# EAGLE design R017 - SRF-Shield v1.2 (EAGLE 6.1)
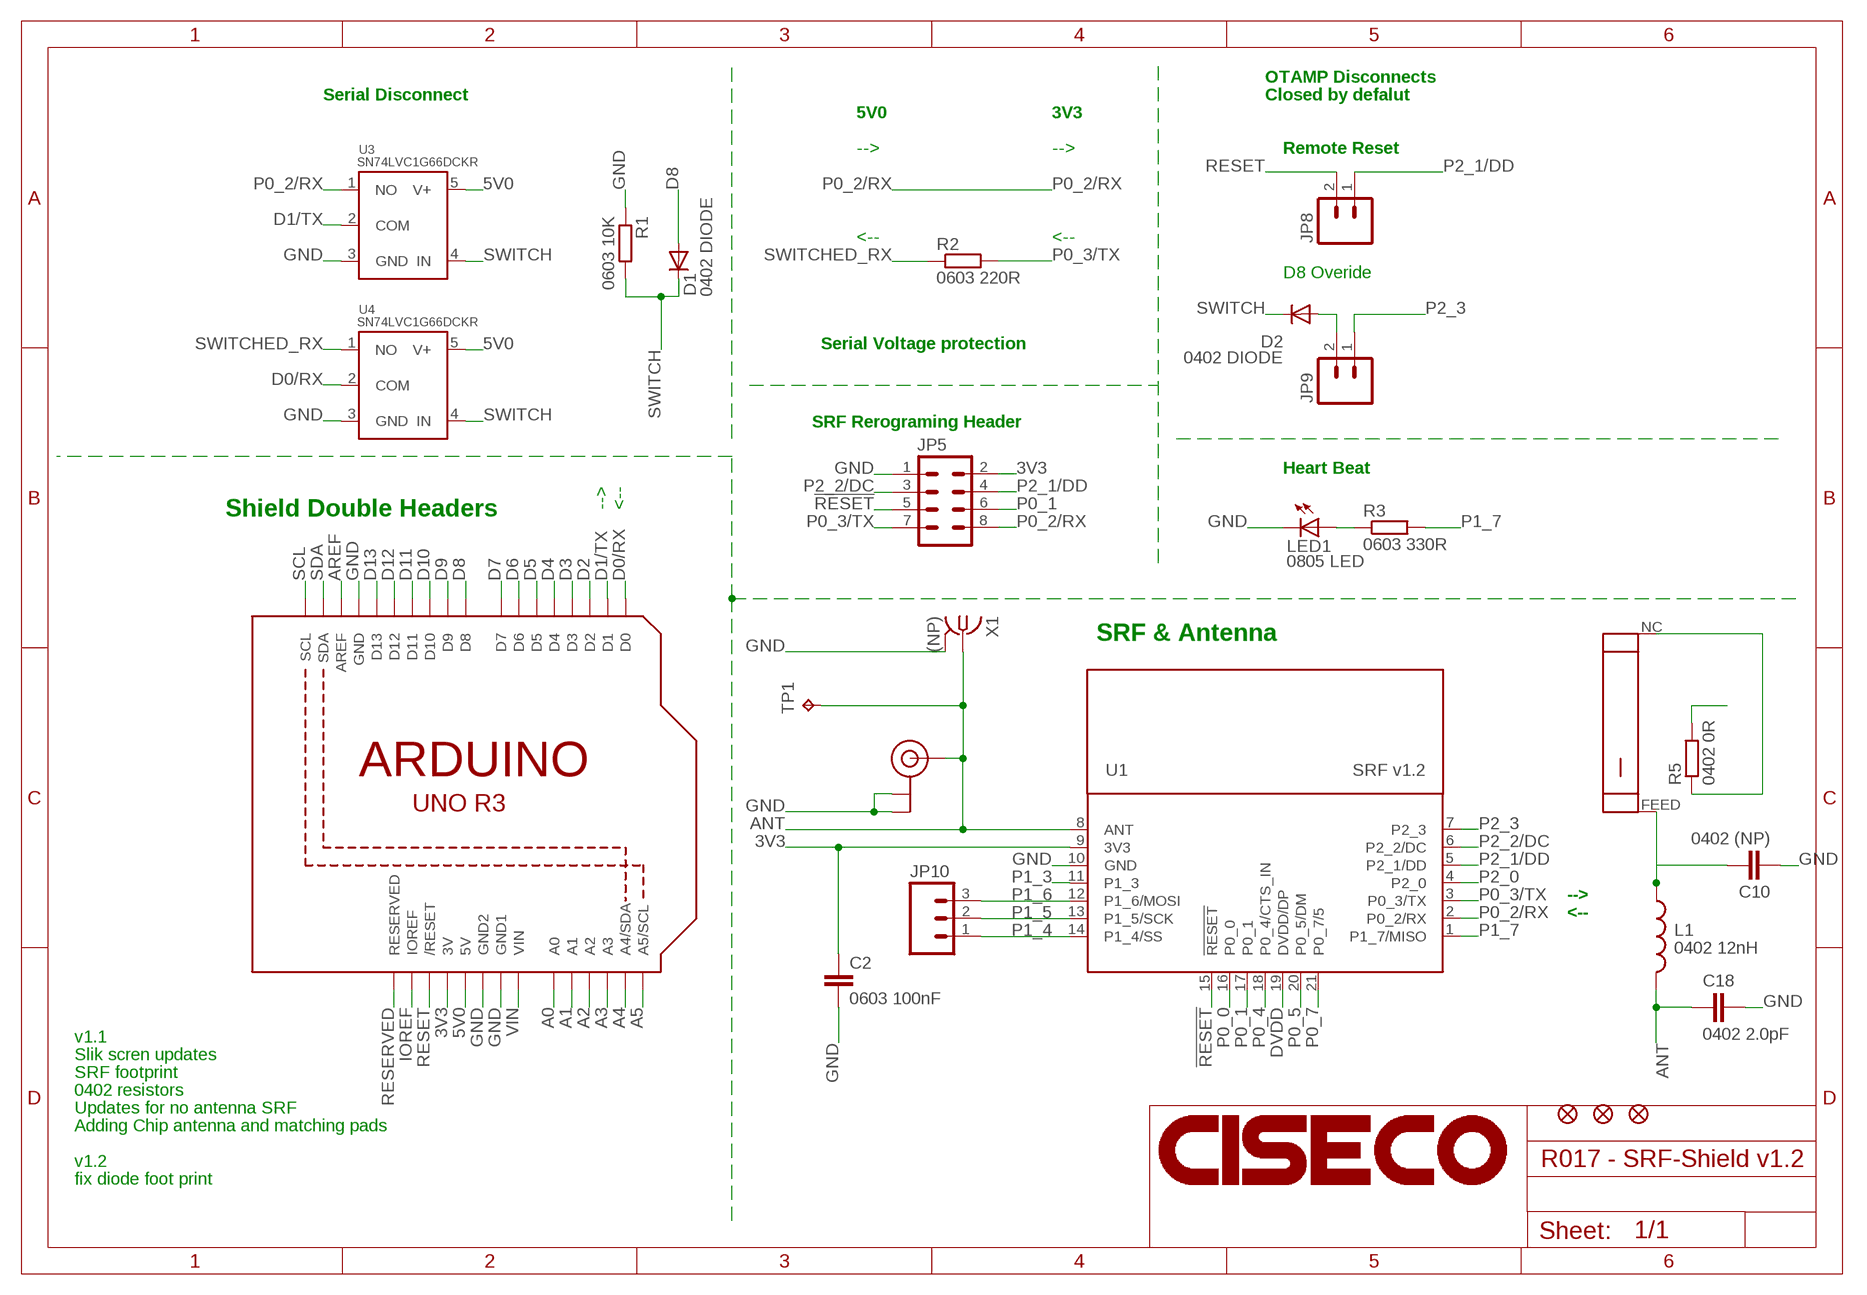
[diagram p0: schematic, sheet 1]

## Parts
C2  0603 100nF  C-EUC0402-SMALLER  [C0402-SMALLER]
C10  0402 (NP)  C-EUC0402-SMALLER  [C0402-SMALLER]
C18  0402 2.0pF  C-EUC0402-SMALLER  [C0402-SMALLER]
D1  0402 DIODE  DIODE-SOD88  [SOD88]
D2  0402 DIODE  DIODE-SOD88  [SOD88]
JP4  FIDUCIAL1X2.5-STOP  [FIDUCIAL-1X2.5-STOP]
JP5  M04X2  [2X4]
JP6  FIDUCIAL1X2.5-STOP  [FIDUCIAL-1X2.5-STOP]
JP7  FIDUCIAL1X2.5-STOP  [FIDUCIAL-1X2.5-STOP]
JP8  M02PTH  [1X02]
JP9  M02PTH  [1X02]
JP10  M03PTH  [1X03]
L1  0402 12nH  INDUCTOR0402-SMALLER  [C0402-SMALLER]
LED1  0805 LED  LED0805-1206  [LED-0805-1206]
R1  0603 10K  R-EU_R0402-SMALLER  [R0402-SMALLER]
R2  0603 220R  R-EU_R0402-SMALLER  [R0402-SMALLER]
R3  0603 330R  R-EU_R0402-SMALLER  [R0402-SMALLER]
R5  0402 0R  R-EU_R0402-SMALLER  [R0402-SMALLER]
TP1  TPPAD1-13  [P1-13]
U1  SRF v1.2  SRF-LANDING-NO-ANT-1.2  [SRF-LANDING-NO-ANT-1.2]
U2  ARDUINOR3-DOUBL-OFFSET  [ARDUINOR3-DOUBLE-OFFSET]
U3  SN74LVC1G66DCKR  TI-TS5A1066-SC7  [SC70]
U4  SN74LVC1G66DCKR  TI-TS5A1066-SC7  [SC70]
U5  U.FL (NP)  U.FL  [U.FL]
U6  JTICHIPANT  JTICHIPANT-ROTATED  [JTICHIPANT-ROT]
U$3  CISECO-LARGE  [CISECO-4MM]
X1  (NP)  SMA-142-0711-821/826-LWK1  [J502-ND-142-0711-821/826-LWK1]

## Nets
3V3: C2.1 JP5.2 U1.9(3V3) U2.3V U2.3V1(3V)
5V0: U2.5V U2.5V1(5V) U3.5(V+) U4.5(V+)
!RESET: JP5.5 U1.15(!RESET)
A0: U2.A0 U2.A6(A0)
A1: U2.A1 U2.A7(A1)
A2: U2.A2 U2.A8(A2)
A3: U2.A3 U2.A9(A3)
A4: U2.A4(A4/SDA) U2.A10(A4/SDA)
A5: U2.A5(A5/SCL) U2.A11(A5/SCL)
ANT [ANT]: C18.1 L1.2 TP1.TP U1.8(ANT) U5.P$3(SIGNAL) X1.1
AREF: U2.AREF U2.AREF1(AREF)
D0/RX: U2.D0 U2.D18(D0) U4.2(COM)
D1/TX: U2.D1 U2.D17(D1) U3.2(COM)
D2: U2.D2 U2.D16(D2)
D3: U2.D3 U2.D15(D3)
D4: U2.D4 U2.D14(D4)
D5: U2.D5 U2.D19(D5)
D6: U2.D6 U2.D20(D6)
D7: U2.D7 U2.D21(D7)
D8: D1.A U2.D8 U2.D22(D8)
D9: U2.D9 U2.D23(D9)
D10: U2.D10 U2.D24(D10)
D11: U2.D11 U2.D25(D11)
D12: U2.D12 U2.D26(D12)
D13: U2.D13 U2.D27(D13)
DVDD: U1.19(DVDD/DP)
GND: C2.2 C10.1 C18.2 JP5.1 LED1.C R1.1 U1.10(GND) U2.GND U2.GND1 U2.GND2 U2.GND3(GND1) U2.GND4(GND2) U2.GND5(GND) U3.3(GND) U4.3(GND) U5.P$1(GND) U5.P$2(GND) X1.G@1(GND)
IOREF: U2.IOREF U2.IOREF1(IOREF)
N$2: LED1.A R3.1
N$11: R5.2
N$39 [ANT]: C10.2 L1.1 U6.FEED
N$40: R5.1 U6.NC
OTAMP_M: D2.A JP9.2
P0_0: U1.16(P0_0)
P0_1: JP5.6 U1.17(P0_1)
P0_2/RX: JP5.8 U1.2(P0_2/RX) U3.1(NO)
P0_3/TX: JP5.7 R2.2 U1.3(P0_3/TX)
P0_4: U1.18(P0_4/CTS_IN)
P0_5: U1.20(P0_5/DM)
P0_7: U1.21(P0_7/5)
P1_3: U1.11(P1_3)
P1_4: JP10.1 U1.14(P1_4/SS)
P1_5: JP10.2 U1.13(P1_5/SCK)
P1_6: JP10.3 U1.12(P1_6/MOSI)
P1_7: R3.2 U1.1(P1_7/MISO)
P2_0: U1.4(P2_0)
P2_1/DD: JP5.4 JP8.1 U1.5(P2_1/DD)
P2_2/DC: JP5.3 U1.6(P2_2/DC)
P2_3: JP9.1 U1.7(P2_3)
RESERVED: U2.RESERVED U2.RESERVED1(RESERVED)
RESET: JP8.2 U2.RESET1(/RESET) U2.RESET(/RESET)
SCL: U2.SCL U2.SCL1(SCL)
SDA: U2.SDA U2.SDA1(SDA)
SWITCH: D1.C D2.C R1.2 U3.4(IN) U4.4(IN)
SWITCHED_RX: R2.1 U4.1(NO)
VIN: U2.VIN U2.VIN1(VIN)

## Notes on the sheet
- OTAMP Disconnects
- Serial Disconnect | Closed by defalut
- 5V0 | 3V3
- --> | --> | Remote Reset
- <-- | <--
- D8 Overide
- Serial Voltage protection
- SRF Rerograming Header
- Heart Beat
- --> | <--
- Shield Double Headers
- SRF & Antenna
- -->
- <--
- v1.1
- Slik scren updates
- SRF footprint
- 0402 resistors
- Updates for no antenna SRF
- Adding Chip antenna and matching pads
- v1.2
- fix diode foot print

## Power pins joined to a net without a drawn wire
GND: X1.G@2(GND) X1.G@3(GND) X1.G@4(GND)

## Library data of the parts
C2 C10 C18 = CISECO eaglecad designs:C-EU: CAPACITOR, European symbol
D1 D2 = CISECO eaglecad designs:DIODE-: DIODE
JP4 JP6 JP7 = CISECO eaglecad designs:FIDUCIAL: Fiducial Alignment Points Various fiducial points for machine vision alignment.
JP5 = SparkFun:M04X2
JP8 JP9 = CISECO eaglecad designs:M02: Header 2 Standard 2-pin 0.1" header. Use with straight break away headers (SKU : PRT-00116), right angle break away headers (PRT-00553), swiss pins (PRT-00743), machine pins (PRT-00117), and female headers (PRT-00115). Molex polarized connector foot print use with SKU : PRT-08233 with associated crimp pins and housings.
JP10 = CISECO eaglecad designs:M03: Header 3 Standard 3-pin 0.1" header. Use with straight break away headers (SKU : PRT-00116), right angle break away headers (PRT-00553), swiss pins (PRT-00743), machine pins (PRT-00117), and female headers (PRT-00115). Molex polarized connector foot print use with SKU : PRT-08232 with associated crimp pins and housings.
L1 = CISECO eaglecad designs:INDUCTOR: Inductors Basic Inductor/Choke - 0603 and 1206. Footprints are not proven and vary greatly between part numbers.
LED1 = CISECO eaglecad designs:LED: LEDs Standard schematic elements and footprints for 5mm, 3mm, 1206, and 0603 sized LEDs. 5mm - Spark Fun Electronics SKU : COM-00529 (and others)
R1-R3 R5 = CISECO eaglecad designs:R-EU_: RESISTOR, European symbol
TP1 = CISECO eaglecad designs:TP: Test pad
U1 = Ciseco Footprints:SRF: SRF Wireless UART Serial Data Module. www.ciseco.co.uk
U2 = CISECO eaglecad designs:ARDUINOR3: This is a new object for the new Arduino R3 - with extra pins that you may want to use (such as IOref, and duplicated A4/A5
U3 U4 = CISECO eaglecad designs:TI-TS5A1066
U5 = CISECO eaglecad designs:U.FL
U6 = CISECO eaglecad designs:JTICHIPANT
U$3 = CISECO eaglecad designs:CISECO
X1 = CISECO eaglecad designs:SMA-: SMA 50 Ohm End Launch Jack Receptacle - Round Contact Johnson Components Source: www.johnsoncomponents.com .. J502-ND.pdf

## Net classes
1 ANT: width 1.27 mm, drill 0.3 mm, clearance 0.381 mm
6 ANT6: width 0.61 mm, drill 0.254 mm, clearance 0.381 mm

## Board
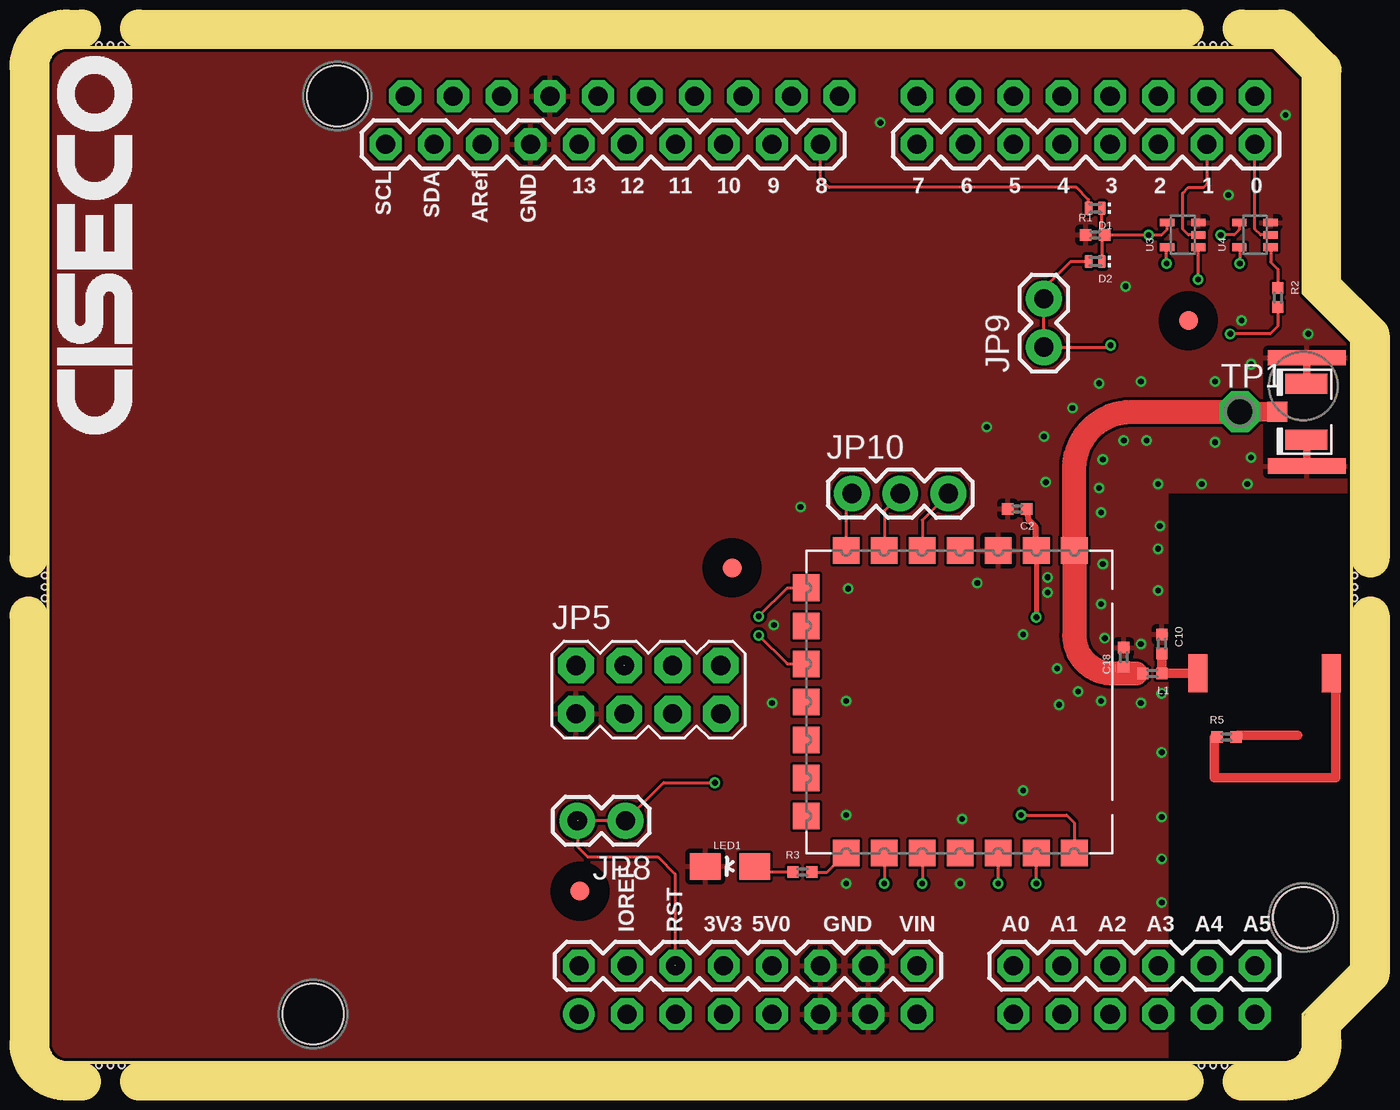
[diagram p1: board, top side]
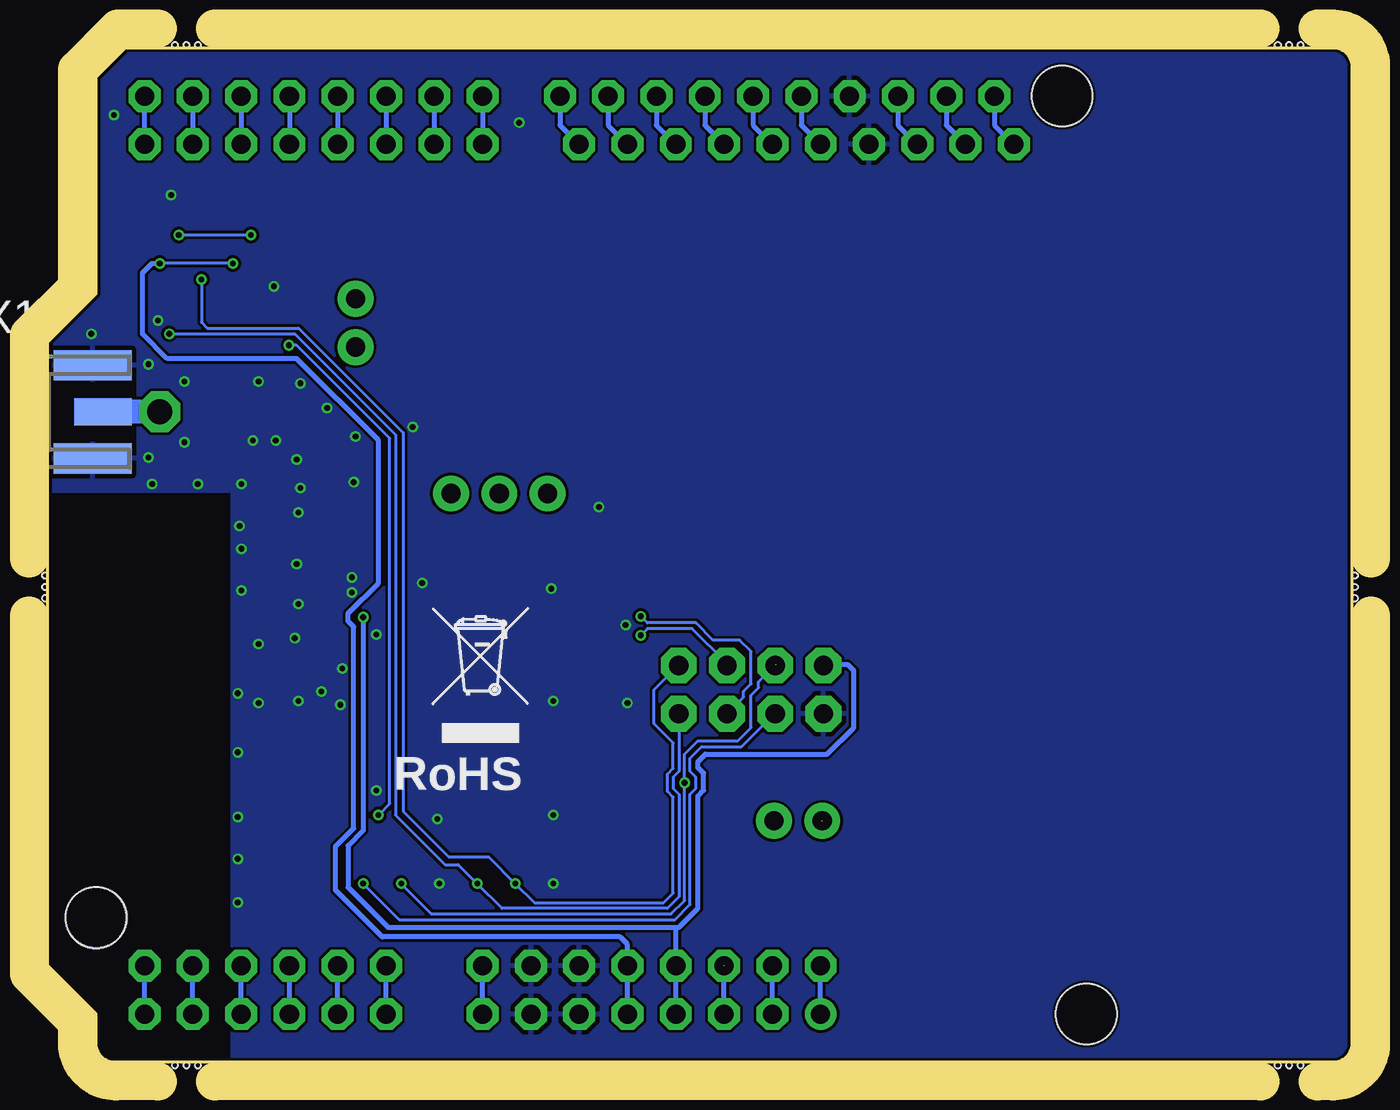
[diagram p2: board, bottom side, seen from below]

Size 68.6 x 53.35 mm. Coordinates in mm from the lower left corner, seen from the top.
Outline: 0,52.35 0,1 arc90 1,0 65.05,0 arc90 66.05,1 66.05,2.55 68.6,5.1 68.6,37.85 66.05,40.4 66.05,51.8 64.5,53.35 1,53.35 arc90 0,52.35
Copper layers (1*16): Top 0.035mm / dielectric 1mm / Bottom 0.035mm
Design rules: minimum track width 0.15mm, minimum drill 0.3mm, track to track 0.15mm, track to pad 0.15mm, pad to pad 0.15mm, via to via 0.15mm, smd to smd 0.15mm, copper to edge 0.15mm, drill to drill 0.15mm, minimum pad ring 10mil, minimum via ring 5mil, stop-mask expansion 4mil, vias tented up to drill 0.6mm, thermal gap 10mil
Holes 3.2 mm at 66.05,7.6 15.24,50.8 13.97,2.54 66.04,7.62
Holes 0.3 mm at 2.7,53.49 3.9,53.49 3.3,53.49 68.73,25.6 68.73,25 68.73,24.4 60.7,53.49 61.3,53.49 61.9,53.49 3.9,-0.15 3.3,-0.15 2.7,-0.15 61.9,-0.15 61.3,-0.15 60.7,-0.15 -0.15,24.4 -0.15,25 -0.15,25.6
tRestrict: area 63.9,31.8 to 68.4,36.6
bRestrict: area 63.9,32.7 to 68.4,35.8
Milling: 18 lines

### Footprints (pad centres in the part's own frame; a part is rotated, then mirrored left to right if it is on the bottom)
C0402-SMALLER = smd 0.6 x 0.6: 1 -0.5,0; 2 0.5,0
SOD88 = smd 0.4 x 0.7: A 0.35,0; C -0.35,0
FIDUCIAL-1X2.5-STOP = smd 1 x 1: 1 0,0
2X4 = drill 1.016 pad 1.88 octagon: 1 -3.81,-1.27; 2 -3.81,1.27; 3 -1.27,-1.27; 4 -1.27,1.27; 5 1.27,-1.27; 6 1.27,1.27; 7 3.81,-1.27; 8 3.81,1.27
1X02 = drill 1.016 pad 1.88: 1 0,0; 2 2.54,0
1X03 = drill 1.016 pad 1.88: 1 0,0; 2 2.54,0; 3 5.08,0
LED-0805-1206 = smd 1.6 x 1.4: A 1.3,0; C -1.3,0
R0402-SMALLER = smd 0.6 x 0.6: 1 -0.5,0; 2 0.5,0
P1-13 = drill 1.321 pad 2.159 octagon: TP 0,0
SRF-LANDING-NO-ANT-1.2 = smd 1.4 x 1.4: 1 15.9,2; 2 15.9,4; 3 15.9,6; 4 15.9,8; 5 15.9,10; 6 15.9,12; 7 15.9,14; 8 0,14; 9 0,12; 10 0,10; 11 0,8; 12 0,6; 13 0,4; 14 0,2; 15 1.95,-0.1; 16 3.95,-0.1; 17 5.95,-0.1; 18 7.95,-0.1; 19 9.95,-0.1; 20 11.95,-0.1; 21 13.95,-0.1
ARDUINOR3-DOUBLE-OFFSET = drill 1 pad 1.676 octagon: 3V 35.56,2.54; 3V1 35.56,5.08; 5V 38.1,2.54; 5V1 38.1,5.08; A0 50.8,2.54; A1 53.34,2.54; A2 55.88,2.54; A3 58.42,2.54; A4 60.96,2.54; A5 63.5,2.54; A6 50.8,5.08; A7 53.34,5.08; A8 55.88,5.08; A9 58.42,5.08; A10 60.96,5.08; A11 63.5,5.08; AREF 23.876,50.8; AREF1 22.86,48.26; D0 63.5,50.8; D1 60.96,50.8; D2 58.42,50.8; D3 55.88,50.8; D4 53.34,50.8; D5 50.8,50.8; D6 48.26,50.8; D7 45.72,50.8; D8 41.656,50.8; D9 39.116,50.8; D10 36.576,50.8; D11 34.036,50.8; D12 31.496,50.8; D13 28.956,50.8; D14 53.34,48.26; D15 55.88,48.26; D16 58.42,48.26; D17 60.96,48.26; D18 63.5,48.26; D19 50.8,48.26; D20 48.26,48.26; D21 45.72,48.26; D22 40.64,48.26; D23 38.1,48.26; D24 35.56,48.26; D25 33.02,48.26; D26 30.48,48.26; D27 27.94,48.26; GND 26.416,50.8; GND1 43.18,2.54; GND2 40.64,2.54; GND3 43.18,5.08; GND4 40.64,5.08; GND5 25.4,48.26; IOREF 30.48,2.54; IOREF1 30.48,5.08; RESERVED1 27.94,5.08; RESET 33.02,2.54; RESET1 33.02,5.08; SCL 18.796,50.8; SCL1 17.78,48.26; SDA 21.336,50.8; SDA1 20.32,48.26; VIN 45.72,2.54; VIN1 45.72,5.08 | drill 1 pad 1.676: RESERVED 27.94,2.54
SC70 = smd 0.4 x 0.75: 1 -0.65,-0.825; 2 0,-0.825; 3 0.65,-0.825; 4 0.65,0.825; 5 -0.65,0.825
U.FL = smd 2.2 x 1.05: P$1 0,1.475; P$2 0,-1.475 | smd 1.05 x 1.05: P$3 1.525,0
JTICHIPANT-ROT = smd 1 x 2: FEED -3.51,0; NC 3.51,0
J502-ND-142-0711-821/826-LWK1 = smd 3 x 1.422: 1 2.815,0 | smd 4.1 x 1.6: G@1 2.265,2.45; G@2 2.265,-2.45 | smd 4.1 x 0.8 bottom: G@3 2.265,2.85; G@4 2.265,-2.85

### Placement (x,y rotation side)
C2  51,29.1 180 top
C10  58.6,22 270 top
C18  56.6,21.3 90 top
D1  55.1,44.9 180 top
D2  55.1,42.1 180 top
JP4  36,26 0 top
JP5  31.6,19.6 0 top
JP6  60,39 0 top
JP7  28,9 0 top
JP8  30.4,12.7 180 top
JP9  52.4,37.6 90 top
JP10  42.3,29.9 0 top
L1  58.1,20.45 180 top
LED1  35.9,10.3 0 top
R1  55.1,43.5 0 top
R2  64.7,40.2 270 top
R3  39.7,10 0 top
R5  62,17.1 0 top
TP1  62.7,34.2 0 top
U1  40,26.9 270 top
U2  0,0 0 top
U3  59.7,43.5 90 top
U4  63.5,43.5 90 top
U5  66.2,34.2 180 top
U6  64,20.45 0 top
U$3  4.5,33 90 top
U$6  [WEEE-LOGO]  48.4,16.8 0 bottom
X1  68.5,34.2 0 bottom

### Tracks (layer width: path | path; a pad name or v marks a point on that pad's centre or on a via)
3V3  (via drill 0.3)
  Top 0.254: U1.9 v52,23.4
  Top 0.305: U1.9 51.98,26.93 51.98,28.12 51.6,28.5 C2.1
  Bottom 0.15: 35.56,7.04 35.5,7.1 35.4,7.1
  Bottom 0.254: 35.4,7.1 34.4,8.1 34.4,14 34.1,14.3 34.1,15.2 34.4,15.5 34.4,15.8 34,16.2 27.6,16.2 26.2,17.6 26.2,20.6 26.5,20.9 27.76,20.9 JP5.2 | v52,23.4 52,12.2 52.8,11.4 52.8,9.2 50.7,7.1 35.5,7.1 | 35.56,7.04 U2.3V1 U2.3V
5V0  (via drill 0.3)
  Top 0.15: U4.5 62.67,42.83 62.7,42.8 v62.7,42 | v58.85,42 58.85,42.83 U3.5
  Bottom 0.15: v58.85,42 v62.7,42
  Bottom 0.254: v62.7,42 63.1,42 63.6,41.5 63.6,38.3 62.3,37 55.5,37 51.2,32.7 51.2,25.2 52.8,23.6 52.8,23.2 52.5,22.9 52.5,12.3 53.45,11.35 53.45,9.05 51,6.6 38.5,6.6 38.1,6.2 U2.5V1 U2.5V
!RESET  (via drill 0.3)
  Top 0.15: U1.15 38.9,24.95 v37.4,23.45
  Bottom 0.15: JP5.5 32,19.2 32,19.5 31.6,19.9 31.6,21.6 32.2,22.2 33.6,22.2 34.5,23.1 37.05,23.1 v37.4,23.45
A0
  Bottom 0.254: U2.A0 U2.A6
A1
  Bottom 0.254: U2.A1 U2.A7
A2
  Bottom 0.254: U2.A2 U2.A8
A3
  Bottom 0.254: U2.A3 U2.A9
A4
  Bottom 0.254: U2.A4 U2.A10
A5
  Bottom 0.254: U2.A5 U2.A11
ANT
  Top 0.5: C18.1 56.6,20.45 57.25,20.45 L1.2
  Top 1.016: U5.P$3 TP1.TP
  Top 1.27: TP1.TP 57,34.2 arc90 54,31.2 U1.8 54,22.45 arc90 56,20.45 57.25,20.45
  Bottom 1.27: TP1.TP X1.1
AREF
  Bottom 0.254: U2.AREF 23.88,49.28 U2.AREF1
D0/RX
  Top 0.15: U4.2 63.8,43.5 63.5,43.8 U2.D18
  Bottom 0.254: U2.D18 U2.D0
D1/TX
  Top 0.15: U3.2 60,43.5 59.7,43.8 59.7,45.7 60,46 60.8,46 61,46.2 61,48.22 U2.D17
  Bottom 0.254: U2.D1 U2.D17
D2
  Bottom 0.254: U2.D2 U2.D16
D3
  Bottom 0.254: U2.D3 U2.D15
D4
  Bottom 0.254: U2.D4 U2.D14
D5
  Bottom 0.254: U2.D5 U2.D19
D6
  Bottom 0.254: U2.D6 U2.D20
D7
  Bottom 0.254: U2.D7 U2.D21
D8
  Top 0.15: U2.D22 40.66,46.44 41.1,46 54.1,46 54.75,45.35 D1.A
  Bottom 0.254: U2.D8 41.66,49.28 U2.D22
D9
  Bottom 0.254: U2.D9 39.12,49.28 U2.D23
D10
  Bottom 0.254: U2.D10 36.58,49.28 U2.D24
D11
  Bottom 0.254: U2.D11 34.04,49.28 U2.D25
D12
  Bottom 0.254: U2.D12 31.5,49.28 U2.D26
D13
  Bottom 0.254: U2.D13 28.96,49.28 U2.D27
GND  (via drill 0.3)
  Top 0.406: U5.P$2 66.23,35.67 X1.G@3 | U5.P$1 66.23,32.73 X1.G@4
  other vias: 58.6,12.9 58.6,16.3 57.5,18.9 57.5,22 58.4,24.8 55.5,26.2 48.9,25.2 51.3,14.3 42,13 42.1,24.9 42,19 53.2,18.8 58.4,30.4 63.1,30.4 63.3,31.8 61.4,32.6 61.4,35.8 63.3,36.7 66.3,38.3 52.5,30.5 52.4,32.9 55.5,31.7 56.6,32.7 57.8,32.7 55.3,35.7 53.9,34.4 51.3,22.5 48.1,12.8 57.5,35.8 58.5,28.2 49.4,33.4 56.7,40.8 62.1,45.6 65.1,49.8 43.8,49.4 39.6,29.2 58.6,10.7 60.7,30.4 52.6,25.5 58.4,27 48,9.4 42,9.4 58.6,8.4 38.1,18.9 38.2,23 62.8,39 52.6,24.7 53.1,20.7 54.2,19.5 55.4,19 58.6,19.4 55.6,22.3 55.4,24.1 55.4,28.9 55.3,30.2
  pour Top: 0,52.35 0,1 arc90 1,0 58.9,0 58.9,30 68.6,30 68.6,37.85 66.05,40.4 66.05,51.8 64.5,53.35 1,53.35 arc90
  pour Bottom: 0,52.35 0,1 arc90 1,0 58.9,0 58.9,30 68.6,30 68.6,37.85 66.05,40.4 66.05,51.8 64.5,53.35 1,53.35 arc90
IOREF
  Bottom 0.254: U2.IOREF U2.IOREF1
N$2
  Top 0.15: R3.1 37.2,10 LED1.A
N$11
  Top 0.5: R5.2 62.6,17.2 65.75,17.2
N$39
  Top 0.5: U6.FEED L1.1 C10.2
N$40
  Top 0.5: U6.NC 67.75,20.45 67.75,14.95 61.35,14.95 61.35,17.1 R5.1
OTAMP_M
  Top 0.15: D2.A 53.8,42.1 52.4,40.7 52.4,40.2 JP9.2
P0_1  (via drill 0.3)
  Top 0.15: U1.17 38.9,20.95 v37.4,22.45
  Bottom 0.15: JP5.6 32.87,20.97 34.7,22.8 37.05,22.8 v37.4,22.45
P0_2/RX  (via drill 0.3)
  Top 0.15: v60.5,41.15 60.5,42.8 60.52,42.83 U3.1 | U1.2 v44,9.4
  Bottom 0.15: v60.5,41.15 60.5,38.9 60.2,38.6 55.4,38.6 49.9,33.1 49.9,13.2 47.5,10.8 45.4,10.8 v44,9.4 43,8.4 36.2,8.4 35.7,8.9 35.7,13.95 36,14.25 36,15.15 35.7,15.45 35.7,16.8 36.7,17.8 36.7,19.6 35.41,20.89 | 35.4,20.9 35.41,20.89 | 35.41,20.89 JP5.8
P0_3/TX  (via drill 0.3)
  Top 0.15: v62.2,38.3 64.3,38.3 64.7,38.7 R2.2 | U1.3 v46,9.4
  Bottom 0.15: v62.2,38.3 55.6,38.3 50.3,33 50.3,13 47.7,10.4 47,10.4 v46,9.4 44.7,8.1 36,8.1 35.4,8.7 35.4,14.1 35.7,14.4 35.7,15 35.4,15.3 JP5.7
P1_3
  Top 0.15: U1.11 47.92,26.98
P1_4
  Top 0.15: JP10.1 42.3,29.8 42,29.5 U1.14
P1_5
  Top 0.15: JP10.2 44.84,29.84 44,29 U1.13
P1_6
  Top 0.15: JP10.3 47.38,29.88 46,28.5 U1.12
P1_7
  Top 0.15: R3.2 41,10 U1.1
P2_1/DD  (via drill 0.3)  (1 unrouted)
  Top 0.15: v50,9.4 U1.5 | 27.9,12.7 JP8.1 32.4,14.7 v35.1,14.7
  Bottom 0.15: 30.3,20.9 31.2,20 31.2,19.7 31.6,19.3 31.6,17.6 32.3,16.9 34.4,16.9 35.1,16.2 v35.1,14.7 35.1,8.5 35.8,7.8 48.42,7.8 48.42,7.82 v50,9.4
P2_2/DC  (via drill 0.3)
  Top 0.15: v52,9.4 U1.6
  Bottom 0.15: JP5.3 30.33,18.37 32.1,16.6 34.2,16.6 34.8,16 34.8,15.3 34.5,15 34.5,14.4 34.8,14.1 34.8,8.3 35.6,7.5 50.1,7.5 v52,9.4
P2_3  (via drill 0.3)
  Top 0.15: 52.4,40.2 JP9.1 55.8,37.6 v55.9,37.7 | v51.2,13 53.6,13 54,12.6 U1.7
  Bottom 0.15: v55.9,37.7 55.5,37.7 50.6,32.8 50.6,13.6 v51.2,13
RESERVED
  Bottom 0.254: U2.RESERVED U2.RESERVED1
RESET  (2 unrouted)
  Top 0.15: 27.9,12.7 27.9,11.3 28.4,10.8 32.1,10.8 33,9.9 33,5.1
  Bottom 0.254: U2.RESET U2.RESET1
SCL
  Bottom 0.254: U2.SCL 18.8,49.28 U2.SCL1
SDA
  Bottom 0.254: U2.SDA 21.34,49.28 U2.SDA1
SWITCH  (via drill 0.3)
  Top 0.15: U4.4 62.67,43.77 62.4,43.5 v61.7,43.5 | 55.65,43.5 v57.9,43.5 58.6,43.5 58.88,43.77 U3.4 | 55.65,43.5 55.45,43.3 D2.C | 55.65,43.5 55.45,43.7 D1.C | R1.2 55.65,43.5
  Bottom 0.15: v61.7,43.5 v57.9,43.5
SWITCHED_RX
  Top 0.15: R2.1 64.71,41.08 64.71,41.09 64.7,41.1 64.7,41.7 64.33,42.08 U4.1
VIN
  Bottom 0.254: U2.VIN U2.VIN1

### Text on the board
bPlace: RoHS
Document: c 2013 | 433MHz | 868MHz | 915MHz | OTAMP | B Disconnect | Sleep | Rst | Sleeping | See manual for setup | ATSM0: Off (Default) | ATSM1: Take Pin LOW | ATSM2: Take Pin HIGH | SRF | Reprogram | OTAMP | A Disconnect | Heart | Beat | v1.2 | Example Sketch | void setup() { | pinMode(8, OUTPUT); | digitalWrite(8, HIGH); | Serial.begin(115200); | Serial.println("Hello World"); | } | void loop() { | } | R017 | SRF Shield | http://docs.ciseco.co.uk/MHF